# Altium schematic sheet Power.SchDoc
size A; SheetNumber: 4; SheetTotal: 4
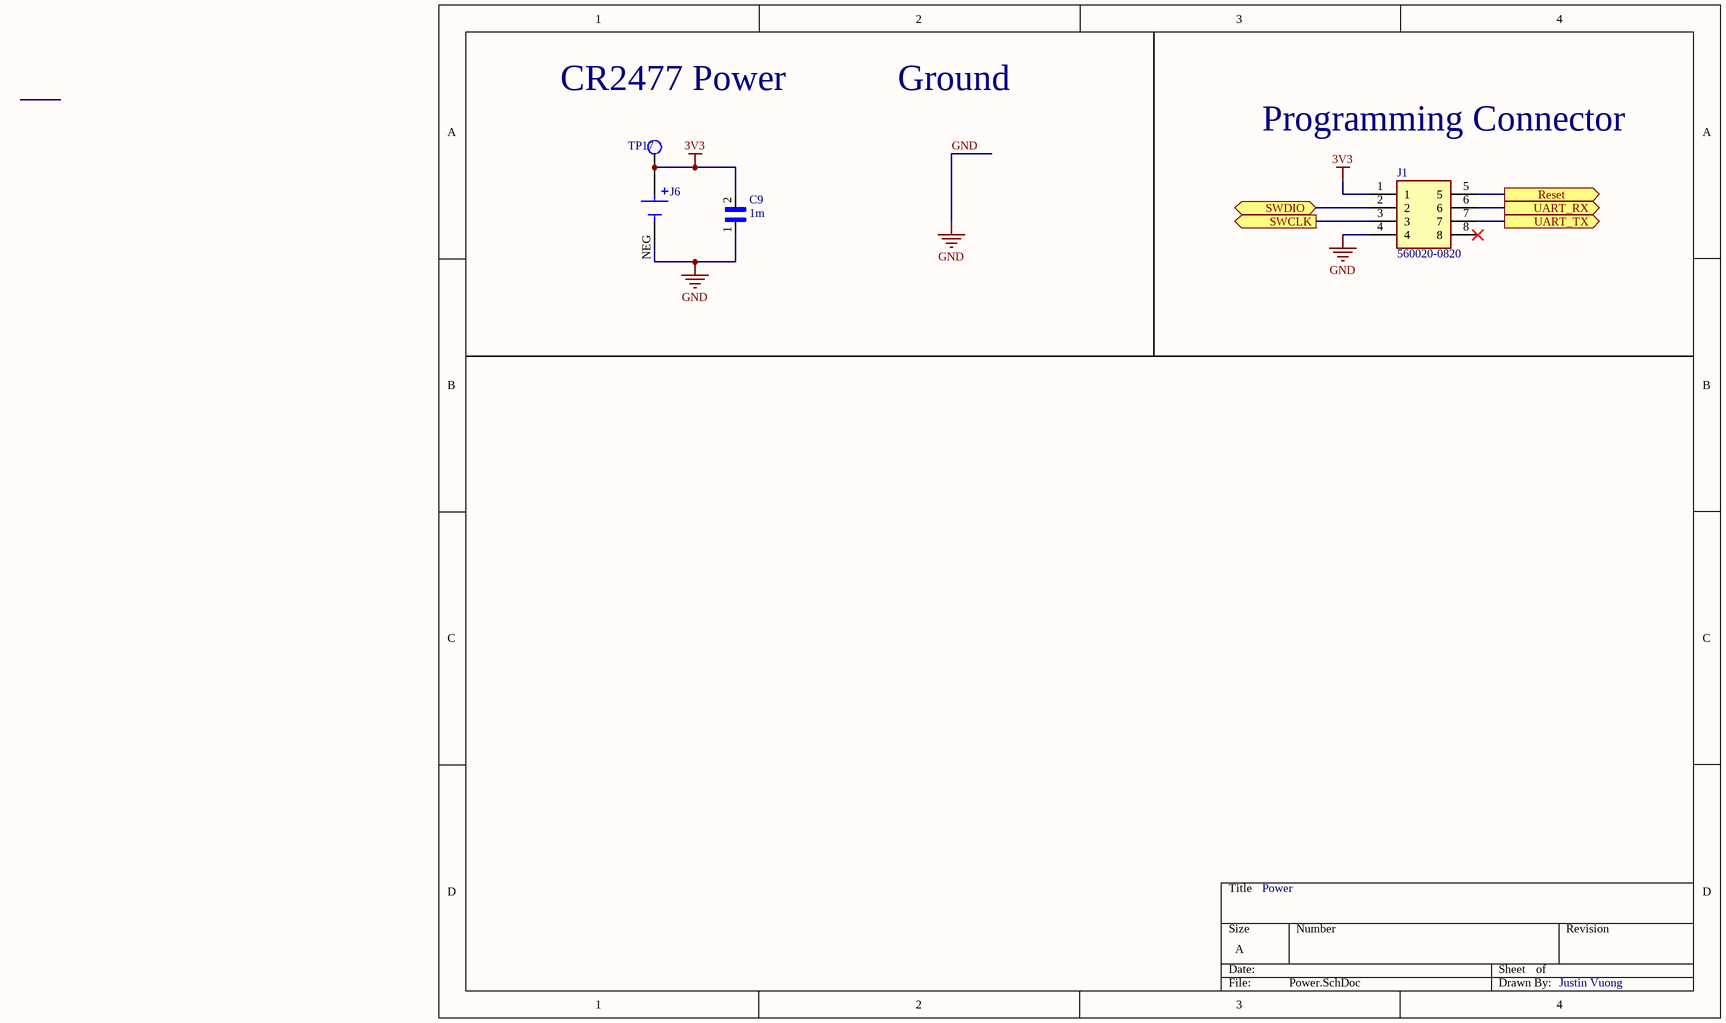
[diagram p0: Power.SchDoc]

## Parts
C9  GRM21BR60E107ME15K  [CAPC2012X145N]  (value not drawn)
J1  560020-0820  [560020-0820]
J6  BRX1-2477-SM  [BAT_BRX1-2477-SM]  (value not drawn)
TP17  TESTPOINT_LOOP  [PCBComponent_1]  (value not drawn)

## Ports
Reset (out, see Proc[3B]), SWCLK (out, see Proc[1B]), SWDIO (bidir, see Proc[1C]), UART_RX (out, see Proc[3B]), UART_TX (out, see Proc[3C])

## Nets
3V3: C9.2 J1.1 J6.1+(POS) J6.2+(POS) TP17.1
GND: C9.1 J1.4 J6.NEG
Reset: J1.5 ; port Reset
SWCLK: J1.3 ; port SWCLK
SWDIO: J1.2 ; port SWDIO
UART_RX: J1.6 ; port UART_RX
UART_TX: J1.7 ; port UART_TX

Not connected (* = marked no-connect by the designer): J1 8*

## Notes on the sheet
- CR2477 Power
- Ground
- Programming Connector
- Power
- Justin Vuong
- (in symbol GRM21BR60E107ME15K) 1m

## Library data of the parts
C9 = GRM21BR60E107ME15K: SMD Capacitor X5R(EIA) with Capacitance: 100uF Tol. 20%. Rated Voltage: 2.5Vdc; Package: None; Price: None; Value: *; MP: GRM21BR60E107ME15K; Availability: Unavailable
J1 = 560020-0820: Connector; Manufacturer_Name: Molex; Datasheet Link: http://www.molex.com/webdocs/datasheets/pdf/en-us//5600200820_PCB_HEADERS.pdf; Manufacturer_Part_Number: 560020-0820; Mouser Part Number: 538-560020-0820; Mouser Price/Stock: https://www.mouser.co.uk/ProductDetail/Molex/560020-0820?qs=4r2B00tbnb1RvRiPBSc%252Bgw%3D%3D
J6 = BRX1-2477-SM: COIN CELL RETAINER 2477 SMT; MF: MPD; Price: None; Package: Non-Standard MPD; Value: *; MP: BRX1-2477-SM; DigiKey-Purchase-URL: https://snapeda.com/shop?store=DigiKey&id=1761043; SnapEDA_Link: https://www.snapeda.com/parts/BRX1-2477-SM/MPD%20(Memory%20Protection%20Devices)/view-part/1761043/?ref=snap; Availability: Warning
TP17 = TESTPOINT_LOOP: PC TEST POINT MINIATURE WHITE; Manufacturer 1: Keystone Electronics; Manufacturer Part Number 1: 5002; Supplier Part Number 1: 36-5002-ND; Supplier 1: Digi-Key; Mount: Through Hole